# EAGLE design USB_adapter (EAGLE 7.3.0)
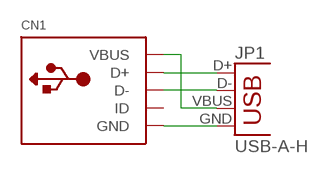
[diagram p0: schematic, sheet 1]

## Parts
CN1  USBMINIB-FEM  [USB-MINIB-FEM]
JP1  USB-A-H  [USB-A-H]

## Nets
D+: CN1.D+ JP1.D+
D-: CN1.D- JP1.D-
GND: CN1.GND JP1.GND
VBUS: CN1.VBUS JP1.VBUS
Unconnected: CN1.ID

## Library data of the parts
CN1 = afa_test:USB: USB Connectors USBMINIB - Surface Mount Female Mini-B USB Connector 4UConnector: 06564 By microbuilder.eu Thru-hole RA Female Mini-B USB Connector 4UConnector: 18732 By ladyada.net
JP1 = SparkFun-Connectors:USB: USB Connectors USB-B-PTH is fully proven SKU : PRT-00139/CONN-08278 USB-miniB is fully proven SKU : PRT-00587 USB-A-PCB is untested. USB-A-H is throughly reviewed, but untested. Spark Fun Electronics SKU : PRT-00437 USB-B-SMT is throughly reviewed, but untested. Needs silkscreen touching up. USB-A-S has not been used/tested USB-MB-H has not been used/tested USB-MICROB has been used. CONN-09505; PROD_ID: CONN-08367

## Board
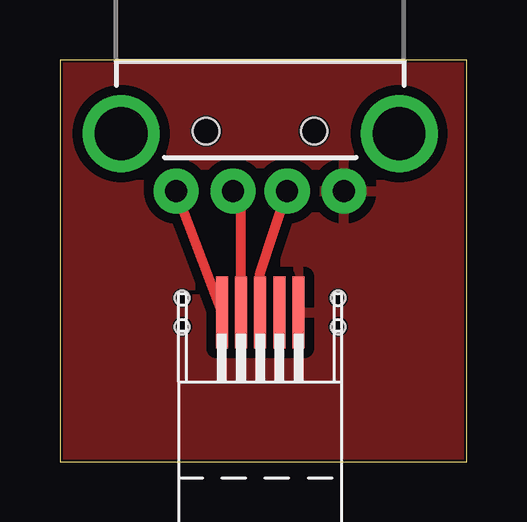
[diagram p1: board, top side]

Size 16.97 x 16.77 mm. Coordinates in mm from the lower left corner, seen from the top.
Outline: 0,0 16.97,0 16.97,16.77 0,16.77 0,0
Copper layers (1*16): Top 0.035mm / dielectric 1.5mm / Bottom 0.035mm
Design rules "default *": minimum track width 10mil, minimum drill 24mil, track to track 16mil, track to pad 16mil, pad to pad 8mil, via to via 8mil, smd to smd 8mil, copper to edge 4mil, drill to drill 8mil, minimum pad ring 10mil, minimum via ring 8mil, stop-mask expansion 4mil, vias tented up to drill 0mil, thermal gap 16mil

### Footprints (pad centres in the part's own frame; a part is rotated, then mirrored left to right if it is on the bottom)
USB-MINIB-FEM = smd 0.5 x 3: D+ 0,4.699; D- -0.8,4.699; GND 1.6,4.699; ID 0.8,4.699; VBUS -1.6,4.699 | hole 0.6: 3.25,5.3; 3.25,4.1; -3.25,5.3; -3.25,4.1
USB-A-H = drill 0.914 pad 1.88: D+ 2.4,1.127; D- 2.4,-1.127; GND 2.4,3.5; VBUS 2.4,-3.5 | drill 2.2: GND2 0,-5.8; GND3 0,5.8 | hole 1.1: -0.1,2.25; -0.1,-2.25

### Placement (x,y rotation side)
CN1  8.35,1.54 0 top
JP1  8.35,13.7 270 top

### Tracks (layer width: path | path; a pad name or v marks a point on that pad's centre or on a via)
D+
  Top 0.406: CN1.D+ 8.35,7.89 JP1.D+
D-
  Top 0.406: CN1.D- 7.55,10.97 JP1.D-
GND
  pour Top: 0,0 0,16.68 17,16.68 17,0
VBUS
  Top 0.406: CN1.VBUS JP1.VBUS